# EAGLE design LPC_4TE_TOP_3_53c (EAGLE 5.04)

## Sheet 1 of 2
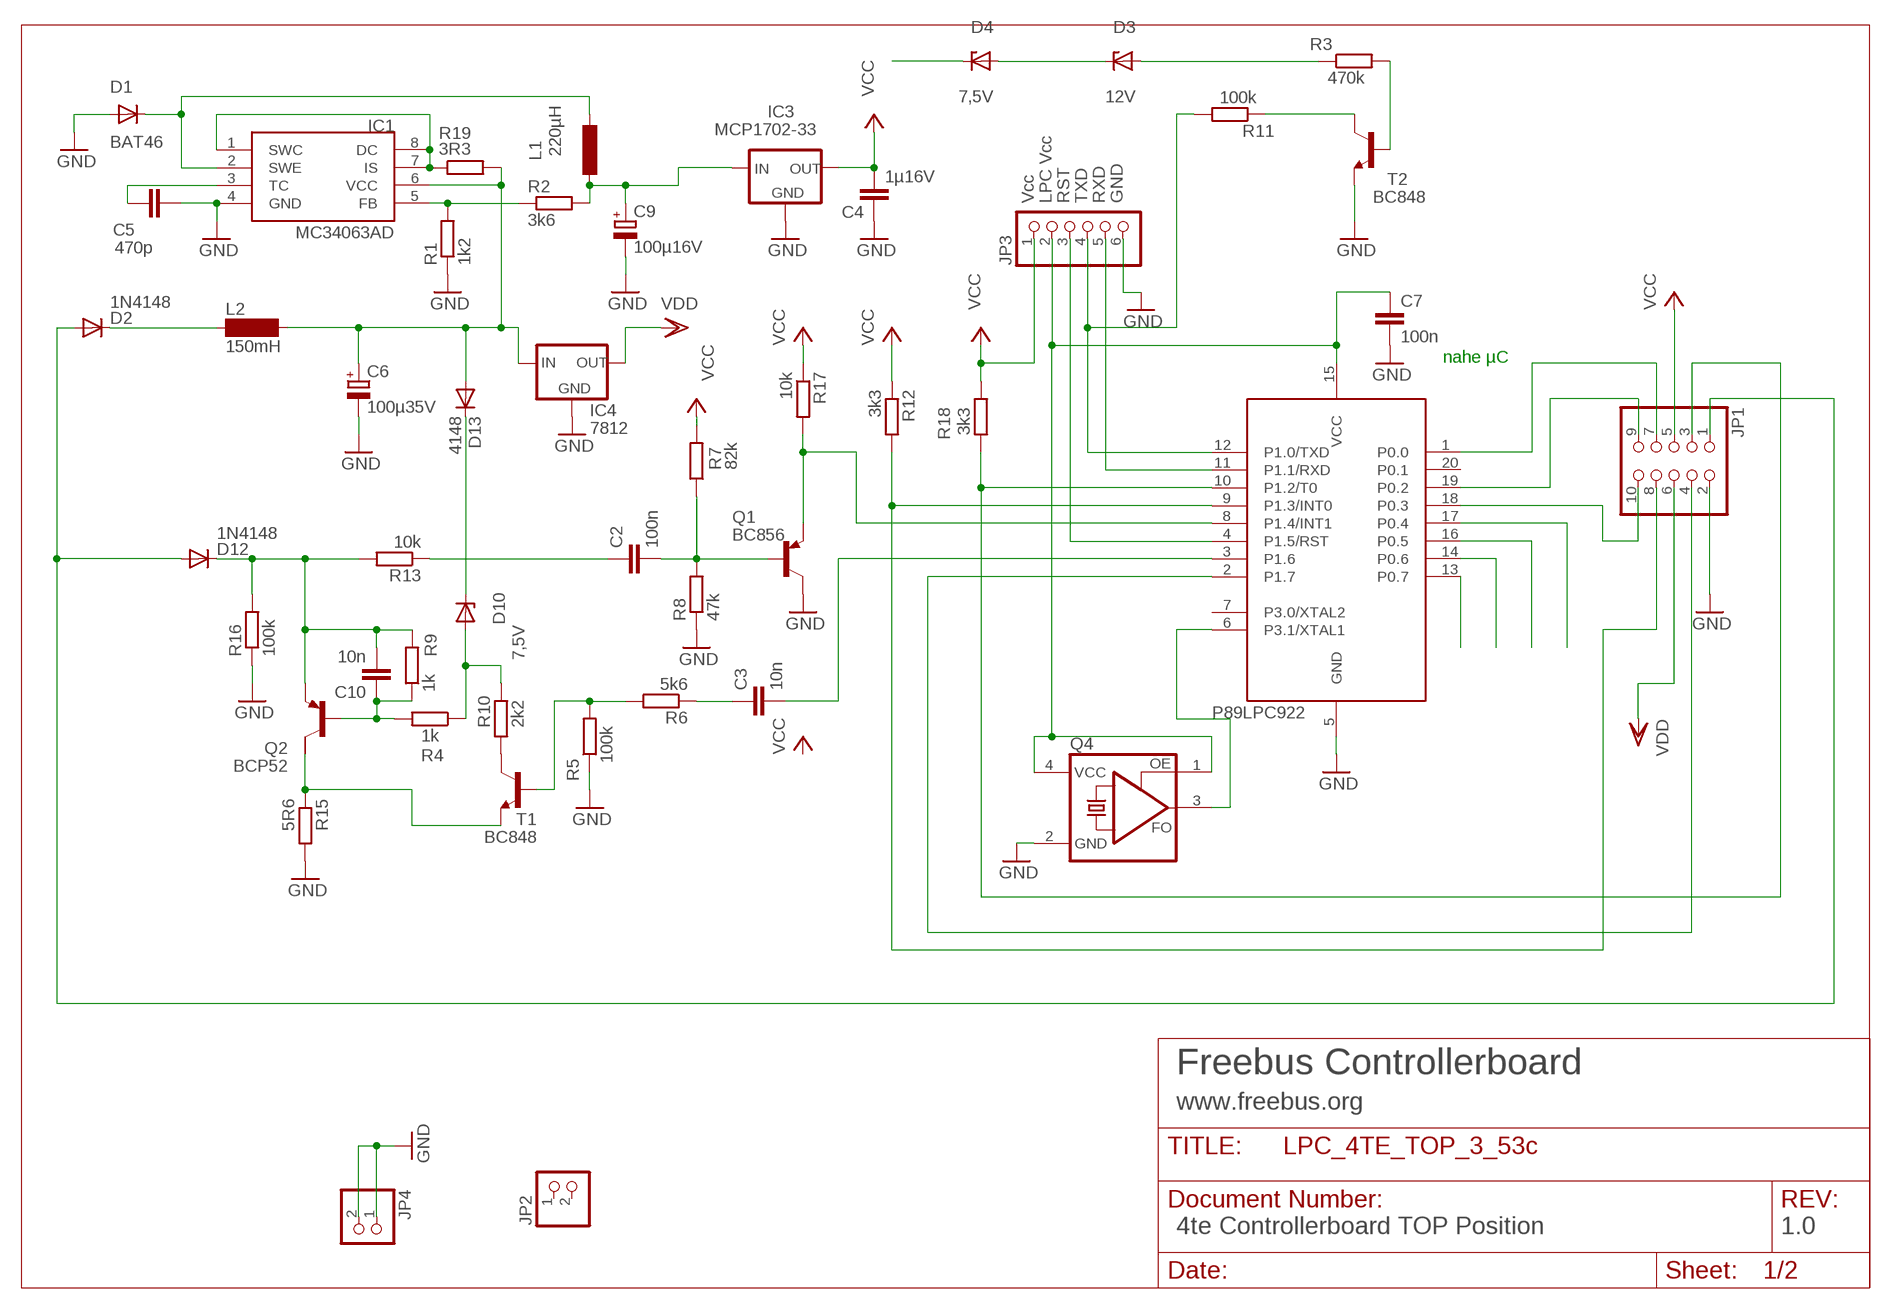
[diagram p0: schematic, sheet 1]

### Parts
C2  100n  C-EUC1206  [C1206]
C3  10n  C-EUC1206  [C1206]
C4  1µ16V  C-EUC1206  [C1206]
C5  470p  C-EUC1206  [C1206]
C6  100µ35V  CPOL-EUE5-8.5  [E5-8,5]
C7  100n  C-EUC1206  [C1206]
C9  100µ16V  CPOL-EUE2.5-5  [E2,5-5]
C10  10n  C-EUC1206  [C1206]
D1  BAT46  DIODE-MINIMELF  [MINIMELF]
D2  1N4148  DIODE-MINIMELF  [MINIMELF]
D3  12V  ZPD  [MINIMELF]
D4  7,5V  ZPD  [MINIMELF]
D10  7,5V  ZPD  [MINIMELF]
D12  1N4148  DIODE-MINIMELF  [MINIMELF]
D13  4148  DIODE-MINIMELF  [MINIMELF]
IC1  MC34063AD  [SOIC8]
IC3  MCP1702-33  79LXX  [79LXX]
IC4  7812  78XXS  [78XXS]
JP1  PINHD-2X5  [2X05]
JP2  PINHD-1X2  [1X02]
JP3  PINHD-1X6  [1X06]
JP4  PINHD-1X2  [1X02]
L1  220µH  L-EU2200-11.43  [2200-11.43]
L2  150mH  SD12-1000  [SD12_1000]
Q1  BC856  BC856ALT1SMD  [SOT23-BEC]
Q2  BCP52  FZT753SMD  [SOT223]
Q4  ASFL  [ASF]
R1  1k2  R-EU_R1206  [R1206]
R2  3k6  R-EU_M1206  [M1206]
R3  470k  R-EU_R1206  [R1206]
R4  1k  R-EU_R1206  [R1206]
R5  100k  R-EU_R1206  [R1206]
R6  5k6  R-EU_R1206  [R1206]
R7  82k  R-EU_R1206  [R1206]
R8  47k  R-EU_M1206  [M1206]
R9  1k  R-EU_R1206  [R1206]
R10  2k2  R-EU_M1206  [M1206]
R11  100k  R-EU_R1206  [R1206]
R12  3k3  R-EU_R1206  [R1206]
R13  10k  R-EU_R1206  [R1206]
R15  5R6  R-EU_R1206  [R1206]
R16  100k  R-EU_M1206  [M1206]
R17  10k  R-EU_R1206  [R1206]
R18  3k3  R-EU_M1206  [M1206]
R19  3R3  R-EU_M1206  [M1206]
T1  BC848  [SOT23]
T2  BC848  [SOT23]
U1  89LPC922  [DIL20]

### Nets
DRAIN: R10.1 T1.3(C)
EIB+: D2.A D12.A JP1.1
EIB_DC: C6.+ D4.C D13.A IC1.6(VCC) IC4.IN L2.2 R19.2
EIB_SEND: C3.2 U1.3(P1.6)
EIBIN: Q1.E R17.2 U1.8(P1.4/INT1)
GATE: R5.2 R6.2 T1.1(B)
GND: C4.1 C5.2 C6.- C7.2 C9.- D1.A IC1.4(GND) IC3.GND IC4.GND JP1.2 JP3.6 JP4.1 JP4.2 Q1.C Q4.2(GND) R1.1 R5.1 R8.1 R15.2 R16.1 T2.2(E) U1.5(GND) ; also sheet 2
INT0: JP1.8 R12.2 U1.9(P1.3/INT0)
N$4: C10.1 Q2.1(B) R4.2 R9.1
N$5: C3.1 R6.1
N$6: C10.2 D12.C Q2.3(E) R9.2 R13.2 R16.2
N$7: Q2.2(C) R15.1 T1.2(E)
N$8: D2.C L2.1
N$9: JP3.5 U1.11(P1.1/RXD)
N$16: JP3.3 U1.4(P1.5/RST)
N$17: D3.C D4.A
N$19: D3.A R3.1
N$20: R3.2 T2.1(B)
N$21: R11.1 T2.3(C)
N$24: JP3.4 R11.2 U1.12(P1.0/TXD)
N$25: Q4.3(FO) U1.6(P3.1/XTAL1)
N$26: C9.+ IC3.IN L1.1 R2.2
N$31: C2.2 Q1.B R7.1 R8.2
N$50: IC1.5(FB) R1.2 R2.1
N$51: D1.C IC1.2(SWE) L1.2
N$52: C5.1 IC1.3(TC)
N$55: D10.A R4.1 R10.2
N$58: D10.C D13.C
N$63: IC1.1(SWC) IC1.7(IS) IC1.8(DC) R19.1
N$77: C2.1 R13.1
P0.0: JP1.7 U1.1(P0.0)
P0.2: JP1.9 U1.19(P0.2)
P0.3: JP1.10 U1.18(P0.3)
P04: U1.17(P0.4) ; also sheet 2
P05: U1.16(P0.5) ; also sheet 2
P06: U1.14(P0.6) ; also sheet 2
P07: U1.13(P0.7)
PROG: JP1.4 U1.2(P1.7)
PWM: JP1.3 R18.2 U1.10(P1.2/T0)
VCC: C4.2 IC3.OUT JP1.5 JP3.1 R7.2 R12.1 R17.1 R18.1 ; also sheet 2
VCC_LPC: C7.1 JP3.2 Q4.1(OE) Q4.4(VCC) U1.15(VCC)
VDD: IC4.OUT JP1.6
Unconnected: JP2.1 JP2.2 Q2.4(C/) U1.7(P3.0/XTAL2) U1.20(P0.1)

### Notes on the sheet
- Vcc | LPC Vcc | RST | TXD | RXD | GND
- nahe µC
- P89LPC922
- Freebus Controllerboard
- www.freebus.org
- 4te Controllerboard TOP Position | 1.0

## Sheet 2 of 2
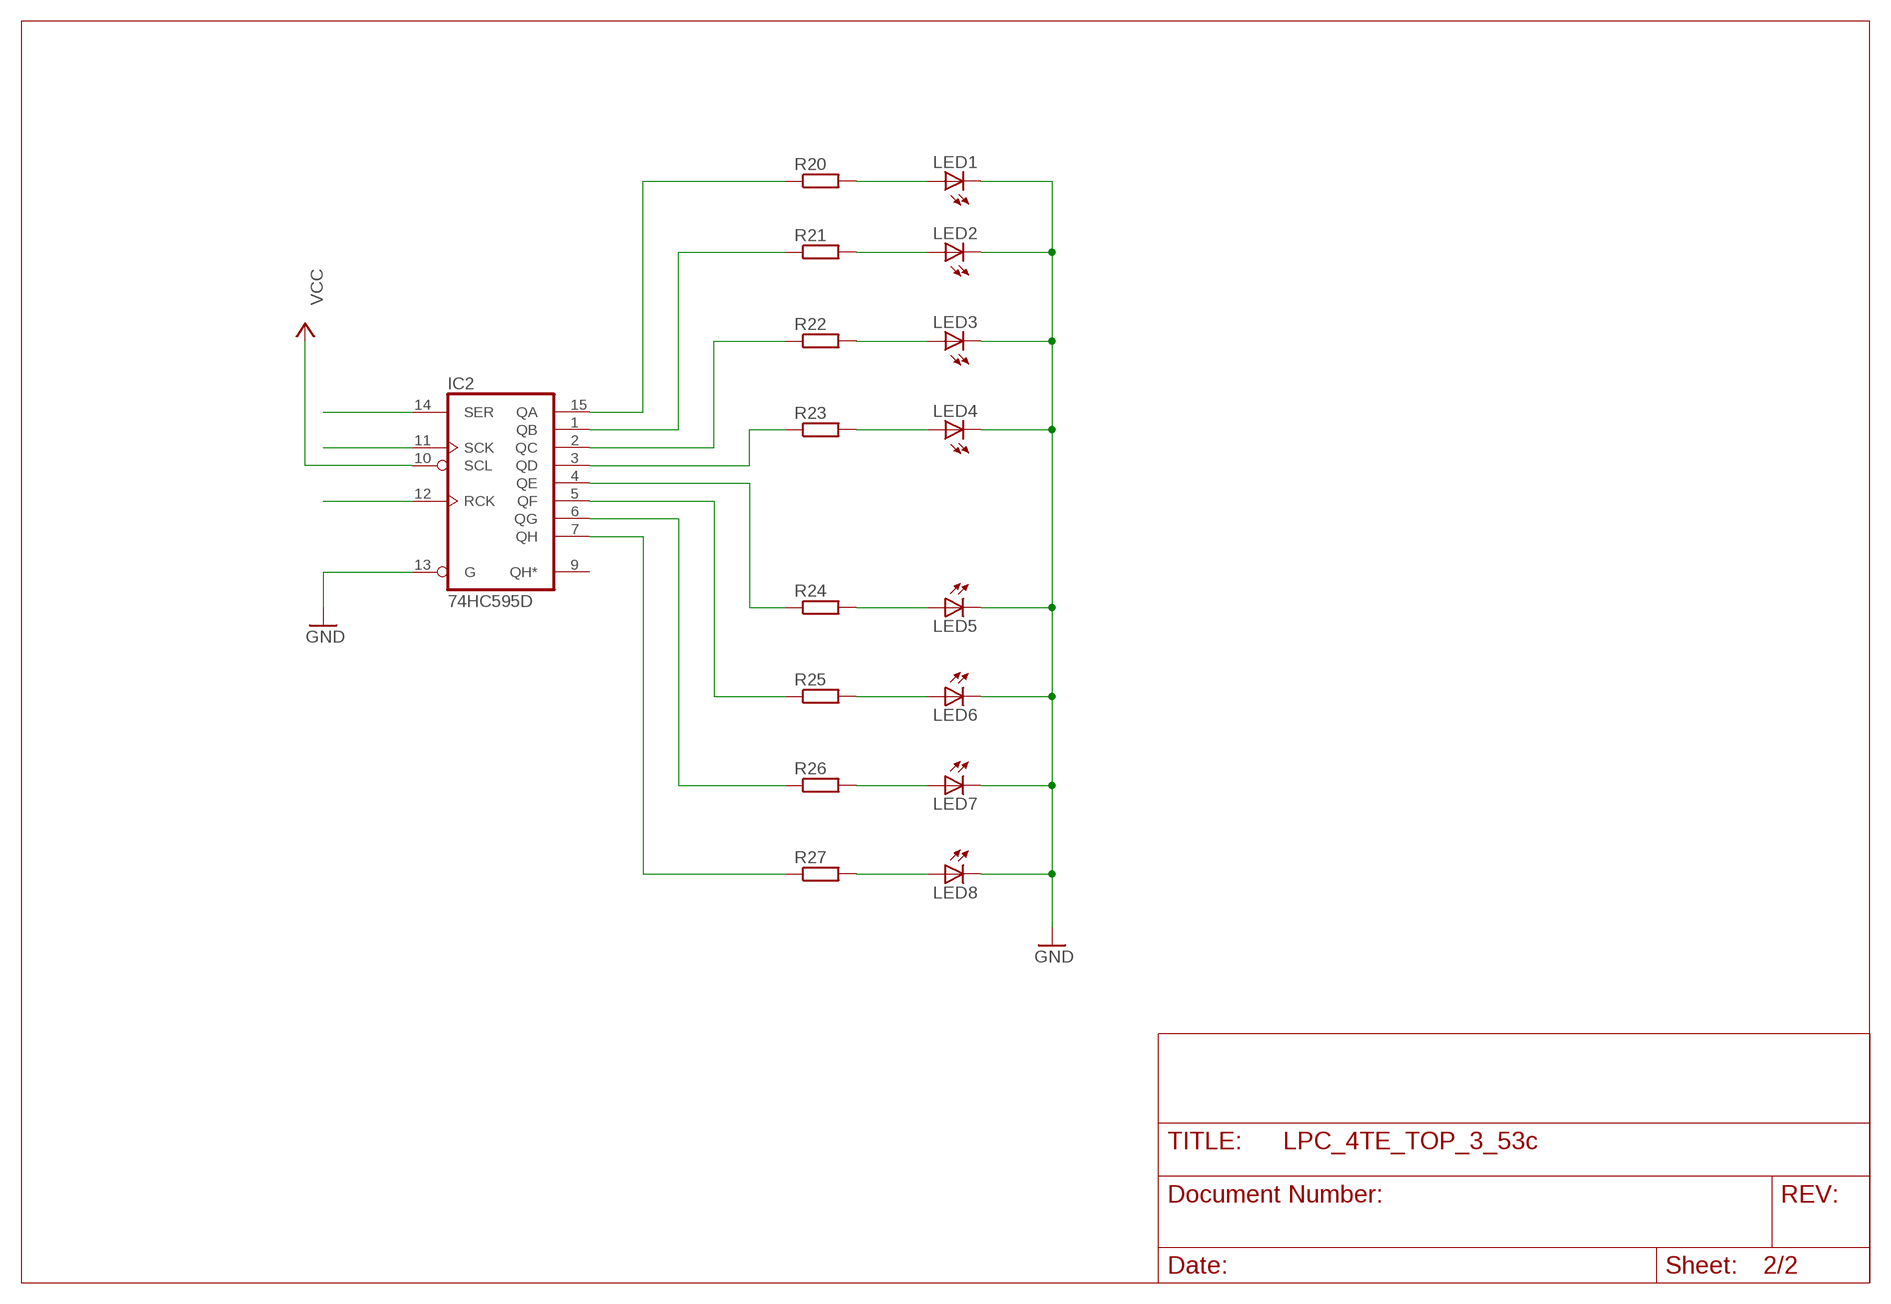
[diagram p1: schematic, sheet 2]

### Parts
IC2  74HC595D  [SO16]
LED1  LED3MM  [LED3MM]
LED2  LED3MM  [LED3MM]
LED3  LED3MM  [LED3MM]
LED4  LED3MM  [LED3MM]
LED5  LED3MM  [LED3MM]
LED6  LED3MM  [LED3MM]
LED7  LED3MM  [LED3MM]
LED8  LED3MM  [LED3MM]
R20  R-EU_R1206  [R1206]
R21  R-EU_R1206  [R1206]
R22  R-EU_R1206  [R1206]
R23  R-EU_R1206  [R1206]
R24  R-EU_R1206  [R1206]
R25  R-EU_R1206  [R1206]
R26  R-EU_R1206  [R1206]
R27  R-EU_R1206  [R1206]

### Nets
GND: IC2.13(G) LED1.K(C) LED2.K(C) LED3.K(C) LED4.K(C) LED5.K(C) LED6.K(C) LED7.K(C) LED8.K(C) ; also sheet 1
N$1: LED1.A R20.2
N$2: LED2.A R21.2
N$3: LED3.A R22.2
N$10: LED4.A R23.2
N$11: LED5.A R24.2
N$13: LED6.A R25.2
N$15: LED7.A R26.2
N$18: LED8.A R27.2
N$22: IC2.15(QA) R20.1
N$23: IC2.1(QB) R21.1
N$28: IC2.2(QC) R22.1
N$29: IC2.3(QD) R23.1
N$30: IC2.7(QH) R27.1
N$32: IC2.6(QG) R26.1
N$33: IC2.5(QF) R25.1
N$34: IC2.4(QE) R24.1
P04: IC2.14(SER) ; also sheet 1
P05: IC2.11(SCK) ; also sheet 1
P06: IC2.12(RCK) ; also sheet 1
VCC: IC2.10(SCL) ; also sheet 1
Unconnected: IC2.9(QH*)

## Power pins joined to a net without a drawn wire
GND: IC2.8(GND)
VCC: IC2.16(VCC)

## Library data of the parts
C2-C5 C7 C10 = rcl:C-EU: CAPACITOR, European symbol
C6 C9 = rcl:CPOL-EU: POLARIZED CAPACITOR, European symbol
D1 D2 D12 D13 = diode:DIODE-: DIODE
D3 D4 D10 = diode:ZPD: Z DIODE 500 mW
IC1 = mc34063:MC34063
IC2 = 74xx-eu:74*595: 8-bit SHIFT REGISTER, output latch
IC3 = v-reg:79LXX: VOLTAGE REGULATOR
IC4 = v-reg:78XXS: VOLTAGE REGULATOR
JP1 = pinhead:PINHD-2X5: PIN HEADER
JP2 JP4 = pinhead:PINHD-1X2: PIN HEADER
JP3 = pinhead:PINHD-1X6: PIN HEADER
L1 = rcl:L-EU: INDUCTOR, European symbol
L2 = inductor-neosid:SD12: INDUCTOR nominal inductance
LED1-LED8 = led:LED: LED OSRAM: - CHIPLED LG R971, LG N971, LY N971, LG Q971, LY Q971, LO R971, LY R971 LH N974, LH R974 LS Q976, LO Q976, LY Q976 LO Q996 - Hyper CHIPLED LW Q18S LB Q993, LB Q99A, LB R99A - SideLED LS A670, LO A670, LY A670, LG A670, LP A670 LB A673, LV A673, LT A673, LW A673 LH A674 LY A675 LS A676, LA A676, LO A676, LY A676, LW A676 LS A679, LY A679, LG A679 - Hyper Micro SIDELED® LS Y876, LA Y876, LO Y876, LY Y876 LT Y87S - SmartLED LW L88C, LW L88S LB L89C, LB L89S, LG L890 LS L89K, LO L89K, LY L89K LS L896, LA L896, LO L896, LY L896 - TOPLED LS T670, LO T670, LY T670, LG T670, LP T670 LSG T670, LSP T670, LSY T670, LOP T670, LYG T670 LG T671, LOG T671, LSG T671 LB T673, LV T673, LT T673, LW T673 LH T674 LS T676, LA T676, LO T676, LY T676, LB T676, LH T676, LSB T676, LW T676 LB T67C, LV T67C, LT T67C, LS T67K, LO T67K, LY T67K, LW E67C LS E67B, LA E67B, LO E67B, LY E67B, LB E67C, LV E67C, LT E67C LW T67C LS T679, LY T679, LG T679 LS T770, LO T770, LY T770, LG T770, LP T770 LB T773, LV T773, LT T773, LW T773 LH T774 LS E675, LA E675, LY E675, LS T675 LS T776, LA T776, LO T776, LY T776, LB T776 LHGB T686 LT T68C, LB T68C - Hyper Mini TOPLED® LB M676 - Mini TOPLED Santana® LG M470 LS M47K, LO M47K, LY M47K Source: http://www.osram.convergy.de - LUMILED® LXK2-PW12-R00, LXK2-PW12-S00, LXK2-PW14-U00, LXK2-PW14-V00 LXK2-PM12-R00, LXK2-PM12-S00, LXK2-PM14-U00 LXK2-PE12-Q00, LXK2-PE12-R00, LXK2-PE12-S00, LXK2-PE14-T00, LXK2-PE14-U00 LXK2-PB12-K00, LXK2-PB12-L00, LXK2-PB12-M00, LXK2-PB14-N00, LXK2-PB14-P00, LXK2-PB14-Q00 LXK2-PR12-L00, LXK2-PR12-M00, LXK2-PR14-Q00, LXK2-PR14-R00 LXK2-PD12-Q00, LXK2-PD12-R00, LXK2-PD12-S00 LXK2-PH12-R00, LXK2-PH12-S00 LXK2-PL12-P00, LXK2-PL12-Q00, LXK2-PL12-R00 Source: www.luxeon.com
Q1 = transistor-pnp:BC856*: PNP Transistror
Q2 = transistor-pnp:FZT753SMD: PNP Transistor
Q4 = crystal:ASF*: CRYSTAL CLOCK OSCILLATORS 5.0 Vdc or 3.3 Vdc - LOW PROFILE ULTRA MINIATURE CERAMIC SURFACE MOUNT Source: http://www.abracon.com/Oscillators/asf1-L-L1.pdf
R1-R13 R15-R27 = rcl:R-EU_: RESISTOR, European symbol
T1 T2 = transistor:BC848: NPN TRANSISTOR
U1 = micro-philips:89LPC922

## Board
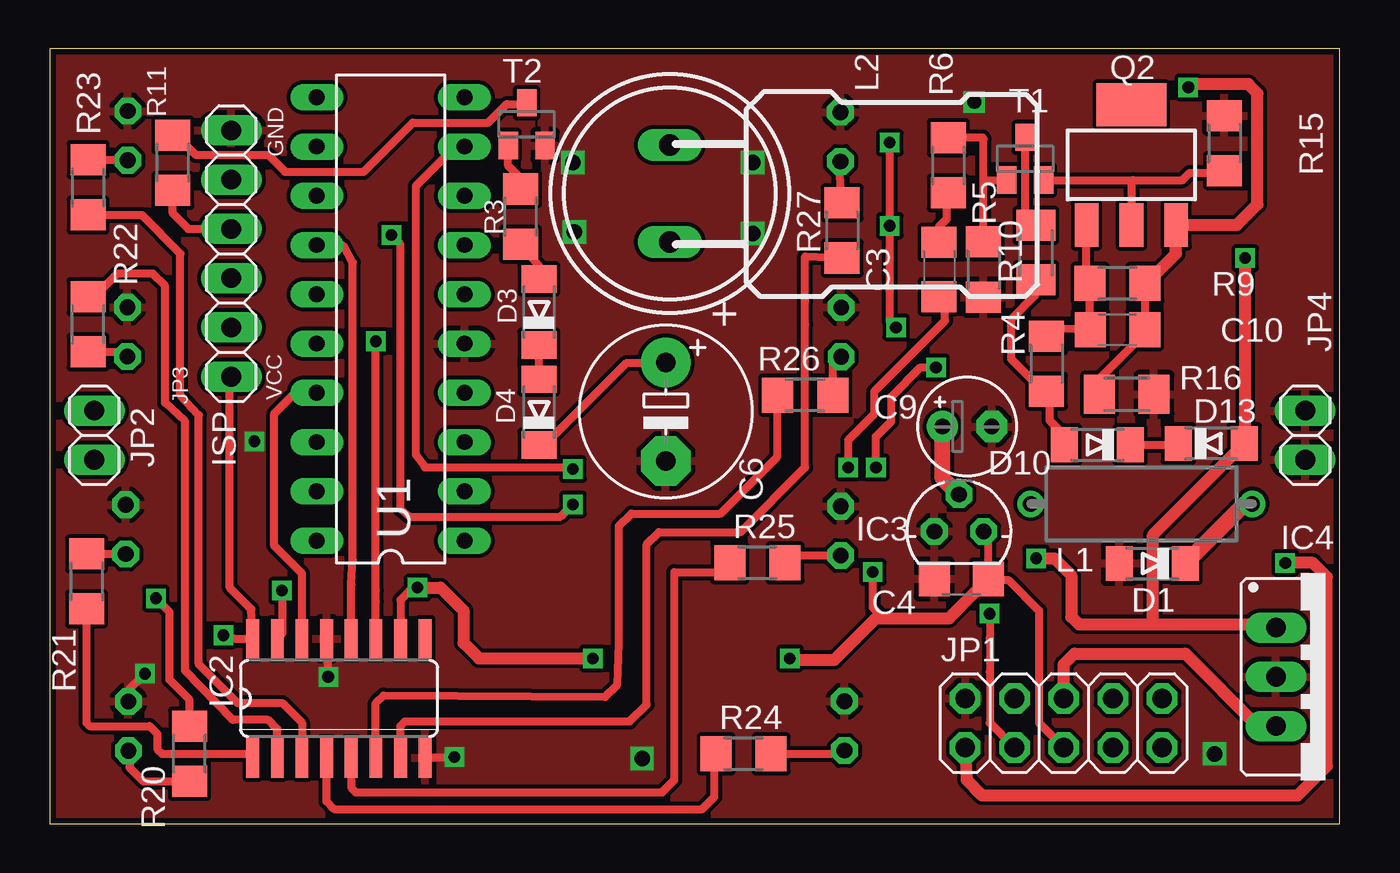
[diagram p2: board, top side]
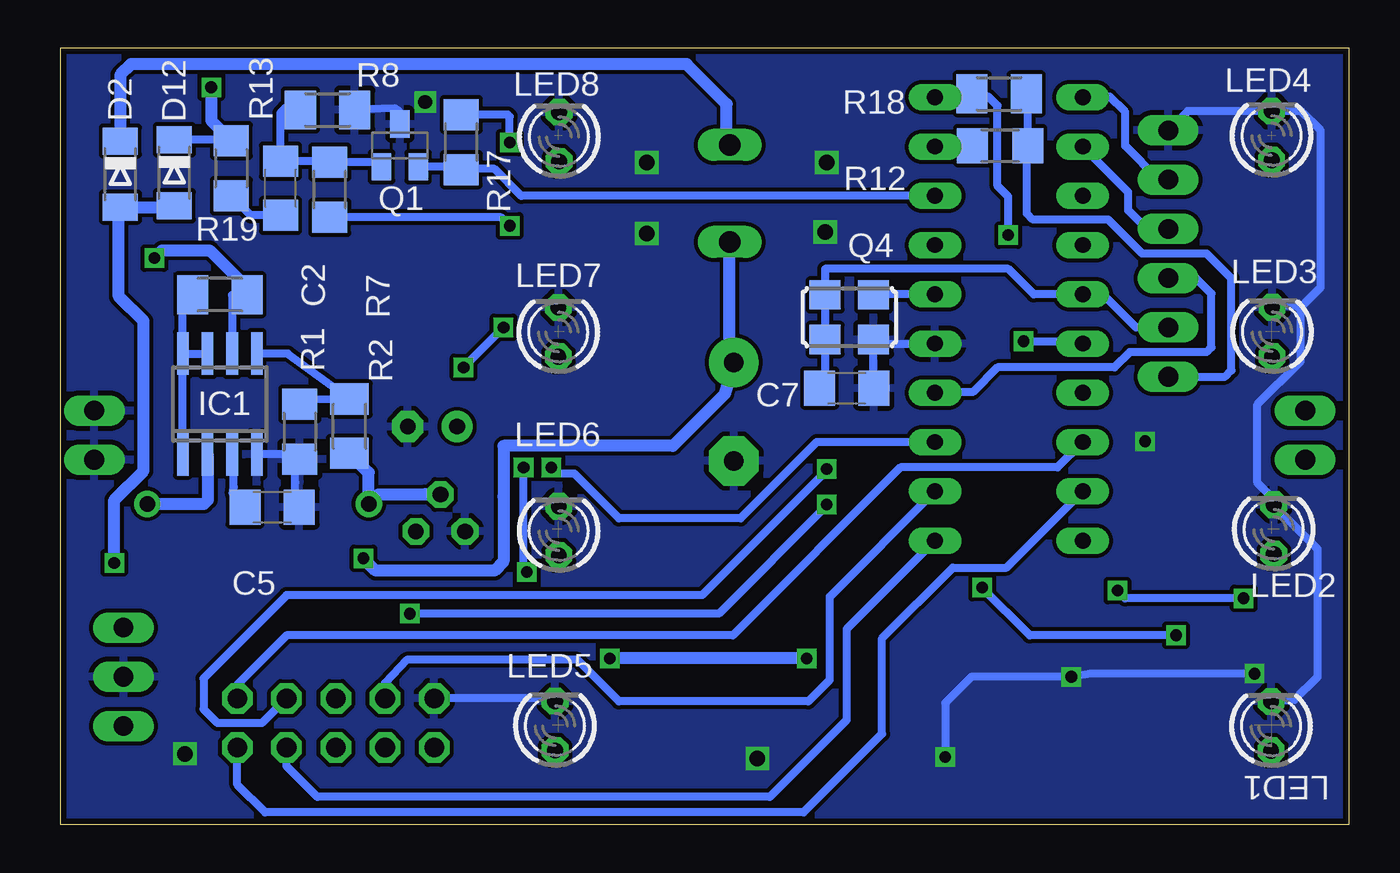
[diagram p3: board, bottom side, seen from below]

Size 66.5 x 40 mm. Coordinates in mm from the lower left corner, seen from the top.
Outline: 0,40 66.5,40 66.5,0 0,0 0,40
Copper layers (1*16): Top 0.035mm / dielectric 1.5mm / Bottom 0.035mm
Design rules "default_freebus": minimum track width 10mil, minimum drill 24mil, track to track 8mil, track to pad 8mil, pad to pad 8mil, via to via 8mil, smd to smd 8mil, copper to edge 12mil, drill to drill 8mil, minimum pad ring 11mil, minimum via ring 8mil, stop-mask expansion 4mil, vias tented up to drill 0mil, thermal gap 10mil

### Footprints (pad centres in the part's own frame; a part is rotated, then mirrored left to right if it is on the bottom)
C1206 = smd 1.6 x 1.8: 1 -1.4,0; 2 1.4,0
E5-8,5 = drill 1.016 pad 2.54 round: + -2.54,0 | drill 1.016 pad 2.54 octagon: - 2.54,0
E2,5-5 = drill 0.813 pad 1.6 round: + -1.27,0 | drill 0.813 pad 1.6 octagon: - 1.27,0
MINIMELF = smd 1.4 x 1.8: A 1.7,0; C -1.7,0
SOIC8 = smd 0.6 x 2.2: 1 -1.905,-2.6; 2 -0.635,-2.6; 3 0.635,-2.6; 4 1.905,-2.6; 5 1.905,2.6; 6 0.635,2.6; 7 -0.635,2.6; 8 -1.905,2.6
SO16 = smd 0.66 x 2.032: 1 -4.445,-3.073; 2 -3.175,-3.073; 3 -1.905,-3.073; 4 -0.635,-3.073; 5 0.635,-3.073; 6 1.905,-3.073; 7 3.175,-3.073; 8 4.445,-3.073; 9 4.445,3.073; 10 3.175,3.073; 11 1.905,3.073; 12 0.635,3.073; 13 -0.635,3.073; 14 -1.905,3.073; 15 -3.175,3.073; 16 -4.445,3.073
79LXX = drill 0.813 octagon: GND -1.27,0; IN 0,1.905; OUT 1.27,0
78XXS = drill 1.016 long: GND 0,-2.54; IN -2.54,-2.54; OUT 2.54,-2.54
2X05 = drill 1.016 octagon: 1 -5.08,-1.27; 2 -5.08,1.27; 3 -2.54,-1.27; 4 -2.54,1.27; 5 0,-1.27; 6 0,1.27; 7 2.54,-1.27; 8 2.54,1.27; 9 5.08,-1.27; 10 5.08,1.27
1X02 = drill 1.016 long: 1 -1.27,0; 2 1.27,0
1X06 = drill 1.016 long: 1 -6.35,0; 2 -3.81,0; 3 -1.27,0; 4 1.27,0; 5 3.81,0; 6 6.35,0
2200-11.43 = drill 0.8 pad 1.27 round: 1 -5.715,0; 2 5.715,0
SD12_1000 = drill 1.1 long: 1 -2.5,0; 2 2.5,0
LED3MM = drill 0.813 octagon: A -1.27,0; K 1.27,0
SOT23-BEC = smd 1 x 1.4: B -0.95,-1.1; C 0,1.1; E 0.95,-1.1
SOT223 = smd 1.219 x 2.235: 1 -2.311,-3.099; 2 0,-3.099; 3 2.311,-3.099 | smd 3.6 x 2.2: 4 0,3.099
ASF = smd 1.6 x 1.5: 1 -1.25,-1.15; 2 1.25,-1.15; 3 1.25,1.15; 4 -1.25,1.15
R1206 = smd 1.6 x 1.803: 1 -1.422,0; 2 1.422,0
M1206 = smd 1.6 x 2: 1 -1.4,0; 2 1.4,0
SOT23 = smd 1 x 1.4: 1 -0.95,-1.1; 2 0.95,-1.1; 3 0,1.1
DIL20 = drill 0.813 long: 1 -11.43,-3.81; 2 -8.89,-3.81; 3 -6.35,-3.81; 4 -3.81,-3.81; 5 -1.27,-3.81; 6 1.27,-3.81; 7 3.81,-3.81; 8 6.35,-3.81; 9 8.89,-3.81; 10 11.43,-3.81; 11 11.43,3.81; 12 8.89,3.81; 13 6.35,3.81; 14 3.81,3.81; 15 1.27,3.81; 16 -1.27,3.81; 17 -3.81,3.81; 18 -6.35,3.81; 19 -8.89,3.81; 20 -11.43,3.81

### Placement (x,y rotation side)
C2  55.13,32.8 90 bottom
C3  45.85,28.6 270 top
C4  47,12.64 0 top
C5  55.56,16.35 0 bottom
C6  31.75,21.27 270 top
C7  25.93,22.49 0 bottom
C9  47.3,20.51 0 top
C10  55.05,25.51 0 top
D1  56.85,13.44 180 top
D2  63.39,33.52 270 bottom
D3  25.21,26.41 90 top
D4  25.21,21.25 90 top
D10  54.01,19.57 180 top
D12  60.61,33.59 270 bottom
D13  59.9,19.63 0 top
IC1  58.26,21.67 0 bottom
IC2  14.89,6.49 0 top
IC3  46.88,15.1 0 top
IC4  65.77,7.6 270 top
JP1  52.28,5.22 0 top
JP2  2.27,20.06 90 top
JP3  9.34,29.43 90 top
JP4  64.74,20.06 90 top
L1  56.29,16.52 0 top
L2  31.96,32.53 270 top
LED1  4.03,5.06 90 bottom
LED2  3.89,15.2 90 bottom
LED3  3.98,25.39 90 bottom
LED4  4,35.5 90 bottom
LED5  40.97,5.07 90 bottom
LED6  40.78,15.13 90 bottom
LED7  40.8,25.38 90 bottom
LED8  40.77,35.45 90 bottom
Q1  48.97,35 0 bottom
Q2  55.77,34 0 top
Q4  25.79,26.14 0 bottom
R1  54.13,20.24 90 bottom
R2  51.58,20.53 270 bottom
R3  24.26,31.33 90 top
R4  51.39,23.75 90 top
R5  48.15,28.6 90 top
R6  46.32,33.98 90 top
R7  52.59,32.72 270 bottom
R8  52.71,36.83 180 bottom
R9  55.05,27.89 0 top
R10  50.85,29.47 270 top
R11  6.32,34.11 270 top
R12  18.01,34.99 180 bottom
R13  57.67,33.83 90 bottom
R15  60.57,35.12 90 top
R16  55.53,22.17 180 top
R17  45.81,35.17 270 bottom
R18  18.06,37.66 180 bottom
R19  58.26,27.31 0 bottom
R20  7.19,3.63 270 top
R21  1.87,12.52 90 top
R22  1.95,25.78 270 top
R23  1.95,32.84 90 top
R24  35.77,3.63 0 top
R25  36.48,13.47 0 top
R26  38.94,22.13 0 top
R27  40.85,30.62 90 top
T1  50.29,34.32 0 top
T2  24.58,36.09 0 top
U1  17.56,26.05 90 top

### Tracks (layer width: path | path; a pad name or v marks a point on that pad's centre or on a via)
DRAIN
  Top 0.406: 50.69,30.79 R10.1 50.29,31.43 T1.3
EIB+  (via drill 0.6)
  Top 0.61: JP1.1 47.28,2.28 48.07,1.49 64.34,1.49 65.85,3 65.85,12.76 65.14,13.47 v63.71,13.47 63.87,13.31
  Bottom 0.61: D12.A 60.68,31.82 D2.A 63.47,31.74 63.47,27.21 62.2,25.94 62.2,18.24 63.71,16.73 v63.71,13.47
EIB_DC  (via drill 0.6)
  Top 0.406: D4.C 25.65,19.71 29.73,23.79 31.73,23.79 C6.+
  Top 0.61: 56.88,10.3 56.88,14.92 D13.A 61.64,19.68 v61.64,29.19 | v50.85,13.71 51.8,13.71 52.67,12.84 52.67,10.7 53.07,10.3 56.88,10.3 | 56.88,10.3 63.07,10.3 IC4.IN
  Bottom 0.406: IC1.6 57.63,27.28 R19.2
  Bottom 0.61: R19.2 56.86,27.66 58.79,29.59 61.25,29.59 v61.64,29.19 | L2.2 31.96,23.68 C6.+ 32.23,22.17 34.89,19.51 43.63,19.51 43.63,16.89 43.63,13.55 44.1,13.08 50.21,13.08 v50.85,13.71
EIB_SEND  (via drill 0.6)
  Top 0.406: C3.2 46.16,26.41 46.16,25.97 42.51,22.32 42.51,21.17 41.16,19.82 v41.16,18.39
  Bottom 0.406: U1.3 27.47,19.7 31.4,15.78 37.67,15.78 39.97,18.08 40.85,18.08 v41.16,18.39
EIBIN
  Bottom 0.406: Q1.E 45.96,33.9 R17.2 | R17.2 45.42,33.75 | U1.8 42.71,32.4 44.1,33.79 45.76,33.79 R17.2
GATE
  Top 0.406: R6.2 48.09,35.4 48.15,35.34 48.15,33.27 | 48.15,33.27 48.15,30.1 R5.2 | T1.1 48.2,33.22 48.15,33.27
GND  (via drill 0.6, 0.7, 0.8)
  Top 0.406: R5.1 48.62,27.34 | LED1.K 4.03,6.9 v4.89,7.76 | v14.34,7.6 14.34,9.48 IC2.13 | IC2.8 20.79,3.41 v20.84,3.47
  Bottom 0.406: C5.2 54.4,16.72 54.37,17.62 54.37,18.9 R1.1 | IC1.4 54.38,19.07 R1.1 | R1.1 53.98,19.29 | R8.1 49.24,36.91 49.02,36.77 49.02,36.15 Q1.C | 2.75,26.73 3.91,26.73 LED3.K | 2.75,26.73 2.43,26.73 1.48,27.68 1.48,35.78 2.47,36.78 LED4.K 8.34,36.78 JP3.6 | 2.75,26.73 2.51,26.49 2.51,23.87 4.73,21.65 4.73,17.6 3.89,16.76 LED2.K 3.89,16.44 1.64,14.19 1.64,7.6 2.83,6.41 3.95,6.41 LED1.K | U1.5 24.33,24.78 Q4.2 C7.2 | v4.89,7.76 13.3,7.76 v14.34,7.6 19.5,7.6 20.84,6.25 v20.84,3.47 | LED5.K 41.11,6.49 JP1.2
  other vias: 47.67,37.24 26.96,34.11 27.04,30.54 36.24,34.11 36.24,30.46 30.53,3.39 60.06,3.63 10.53,19.74
  pour Top: -0.75,41.33 66.25,41.33 67.76,39.83 67.76,0.38 66.33,-1.05 -0.51,-1.05 -1.14,-0.42
  pour Bottom: -0.98,42.68 67.28,42.68 68.31,41.65 68.31,0.38 66.8,-1.13 -0.9,-1.13 -1.38,-0.66
INT0  (via drill 0.6)
  Top 0.406: U1.9 20.88,34.94 18.86,32.92 18.86,19.03 19.34,18.39 26.72,18.39 v26.96,18.32
  Bottom 0.406: R12.2 21.34,34.91 U1.9 | v26.96,18.32 26.96,18.24 33.39,11.81 54.82,11.81 59.1,7.52 59.1,5.93 58.39,5.22 56.09,5.22 JP1.8
N$1
  Top 0.406: R20.2 4.8,2.21 4.1,2.92 4.1,3.72 LED1.A
N$2
  Top 0.406: R21.2 3.89,13.94 LED2.A
N$3
  Top 0.406: R22.2 3.98,24.35 LED3.A
N$4
  Top 0.406: Q2.1 53.46,28.06 R9.1 53.63,25.53 | 53.63,25.53 C10.1 | 53.63,25.53 52.04,25.57 R4.2
N$5
  Top 0.406: C3.1 45.85,30.81 46.24,31.21 46.24,32.47 R6.1
N$6  (via drill 0.6)
  Top 0.406: R9.2 56.48,25.53 C10.2 56.45,25.31 54.18,23.03 54.18,22.22 R16.2
  Top 0.61: R9.2 56.53,27.89 58.07,29.43 Q2.3 61.21,30.9 62.28,31.97 62.28,37.68 61.8,38.16 58.87,38.16 v58.71,38
  Bottom 0.406: D12.C 57.79,35.29 57.67,35.5 R13.2
  Bottom 0.61: v58.71,38 58.71,36.28 R13.2
N$7
  Top 0.406: T1.2 55.85,33.22 | Q2.2 55.77,33.14 55.85,33.22 | 55.85,33.22 58.41,33.22 58.78,33.59 60.45,33.59 R15.1
N$8
  Bottom 0.61: D2.C 63.39,38.63 62.83,39.19 34.18,39.19 32.12,37.13 32.12,35.18 L2.1
N$9
  Bottom 0.406: JP3.5 9.81,33.24 11.56,34.98 11.56,36.73 12.35,37.52 13.71,37.52 U1.11
N$10
  Top 0.406: R23.2 4,34.26 LED4.A
N$11
  Top 0.406: R24.2 40.8,3.63 LED5.A
N$13
  Top 0.406: R25.2 38.29,13.86 LED6.A
N$15
  Top 0.406: R26.2 40.36,23.67 LED7.A
N$16
  Bottom 0.406: JP3.3 7.91,28.16 7.11,27.36 7.11,24.59 7.35,24.35 11.32,24.35 12.11,23.55 18.15,23.55 19.42,22.28 21.33,22.28 U1.4
N$17
  Top 0.406: D4.A 25.21,25.11 D3.C
N$18
  Top 0.406: R27.2 40.68,34.09 LED8.A
N$19
  Top 0.406: D3.A 25.21,28.8 R3.1
N$20
  Top 0.406: R3.2 24.26,33.32 23.62,33.95 T2.1
N$21
  Top 0.406: R11.1 6.48,35.53 7.51,34.51 11.24,34.51 12.11,33.63 16.16,33.63 18.7,36.17 22.59,36.17 23.54,37.13 24.51,37.13 T2.3
N$22  (via drill 0.6)
  Top 0.406: R20.1 7.19,6.41 6.16,7.44 6.16,10.93 v5.45,11.65 | v11.95,12.04 11.95,9.8 IC2.15
  Bottom 0.406: v5.45,11.65 11.56,11.65 v11.95,12.04
N$23
  Top 0.406: R21.1 1.87,5.22 2.03,5.06 5.13,5.06 5.53,4.66 5.53,3.87 5.76,3.63 10.23,3.63 IC2.1
N$24
  Top 0.406: JP3.4 7.11,30.7 6.32,31.49 R11.2
  Bottom 0.406: JP3.4 10.45,30.7 11.4,31.65 11.4,32.59 U1.12
N$25
  Bottom 0.406: U1.6 24.51,27.32 Q4.3
N$26
  Top 0.813: C9.+ 46.03,17.85 IC3.IN
  Bottom 0.61: 47.67,17.02 IC3.IN 50.09,17 L1.1 50.58,18.13 R2.2
N$28
  Top 0.406: R22.1 2.26,27.2 3.46,28.4 5.29,28.4 5.92,27.76 5.92,21.73 6.95,20.78 6.95,7.92 9.41,5.38 11.24,5.38 11.72,4.9 IC2.2
N$29
  Top 0.406: R23.1 1.64,31.41 4.73,31.41 6.72,29.43 6.72,22.13 7.67,21.09 7.67,8.23 9.65,6.25 11.95,6.25 12.99,5.22 IC2.3
N$30
  Top 0.406: IC2.7 18.07,5.06 18.3,5.3 29.89,5.3 30.77,6.17 30.77,14.43 31.4,15.06 35.61,15.06 38.94,18.39 38.94,25.78 38.94,26.97 38.94,29.28 R27.1
N$31
  Bottom 0.406: R8.2 54.17,36.92 54.89,36.92 55.13,36.69 C2.2 52.65,34.2 R7.1 50.16,34.14 Q1.B
N$32
  Top 0.406: IC2.6 16.8,6.25 17.19,6.65 28.62,6.57 29.26,7.2 29.34,9.35 29.34,15.38 29.97,16.01 34.58,16.01 37.51,18.95 R26.1
N$33
  Top 0.406: IC2.5 15.53,1.88 15.76,1.65 31.56,1.65 32.2,2.28 32.2,13 34.58,13 R25.1
N$34
  Top 0.406: IC2.4 14.26,1.17 14.65,0.77 33.62,0.77 34.26,1.41 34.26,3.62 R24.1
N$50
  Bottom 0.406: IC1.5 54.76,24.27 R2.1 54.26,21.85 R1.2
N$51
  Top 0.813: D1.C 61.62,16.52 L1.2
  Bottom 0.61: IC1.2 58.87,19.04 58.87,16.73 59.08,16.52 L1.2
N$52
  Bottom 0.406: C5.1 57.6,17.02 57.55,17.38 57.55,18.99 IC1.3
N$55
  Top 0.406: D10.A 52.31,20.06 51.56,20.81 51.56,22.31 R4.1 51.24,22.33 49.58,23.99 49.58,26.05 50.77,27.24 50.77,27.99 R10.2
N$58
  Top 0.406: 58.11,19.54 D13.C 58.13,19.57 D10.C
N$63
  Bottom 0.406: IC1.8 60.17,26.86 R19.1 | IC1.8 IC1.7 | IC1.1 IC1.8
N$77
  Bottom 0.406: C2.1 56.66,31.4 R13.1
P0.0
  Bottom 0.406: U1.1 25.92,10.07 25.92,5.38 29.89,1.41 53.23,1.41 54.82,3 JP1.7
P0.2
  Bottom 0.406: U1.19 17.67,13.24 20.45,13.24 24.1,9.58 24.1,4.66 28.15,0.61 55.93,0.61 57.36,2.04 JP1.9
P0.3
  Bottom 0.406: U1.18 15.06,18.39 23.15,18.39 31.8,9.74 54.82,9.74 57.36,7.2 JP1.10
P04
  Top 0.406: IC2.14 12.99,12.92 11.56,14.35 11.56,21.17 12.67,22.28 13.71,22.28 U1.17
P05  (via drill 0.6)
  Top 0.406: IC2.11 16.8,11.49 16.8,12.04 v16.8,24.9
  Bottom 0.406: v16.8,24.9 13.87,24.9 U1.16
P06
  Top 0.406: IC2.12 15.53,12.36 15.61,13.63 15.61,28.95 15.13,29.82 13.79,29.82 U1.14
PROG
  Bottom 0.406: U1.2 26.8,11.73 26.8,7.44 27.91,6.33 37.67,6.33 39.82,8.47 48.63,8.47 49.74,7.28 JP1.4
PWM  (via drill 0.6)
  Top 0.406: v26.96,16.49 26.32,15.85 18.54,15.85 18.07,16.25 18.07,29.9 v17.59,30.38 | v48.47,10.85 48.47,9.58 48.47,7.84 48.47,5.22 JP1.3
  Bottom 0.406: R18.2 21.31,37.42 U1.10 21.33,37.52 18.62,37.52 18.15,37.05 18.15,32.92 17.59,32.36 v17.59,30.38 | v26.96,16.49 26.96,16.41 32.51,10.85 v48.47,10.85
VCC  (via drill 0.6)
  Top 0.406: JP3.1 9.26,23 9.26,12.2 10.37,11.09 IC2.16 9.6,9.56 v8.94,9.74 | v18.94,12.2 18.7,12.2 18.07,11.57 IC2.10 | IC2.10 | JP1.5 51.01,5.22 51.01,11.01 49.42,12.6 48.44,12.6 C4.2 48.4,14.84 IC3.OUT | v43.31,35.14 v43.31,30.86 43.31,25.94 v43.63,25.62 | v42.43,13 42.43,11.17 42.99,10.61 | v45.69,23.55 44.9,23.55 43.39,22.05 43.39,20.78 42.59,19.98 v42.59,18.39
  Top 0.61: v38.15,8.55 38.31,8.47 40.45,8.47 42.59,10.61 42.99,10.61 46.37,10.61 C4.2 | v27.99,8.55 22.11,8.55 21.32,9.35 21.32,11.01 20.13,12.2 v18.94,12.2
  Bottom 0.406: 45.75,36.59 R17.1 43.41,36.59 43.31,36.49 v43.31,35.14 | JP3.1 8.46,23.08 6.4,23.08 6.08,23.4 6.08,28.16 7.35,29.43 10.68,29.43 12.43,31.17 16.32,31.17 16.64,31.49 16.64,34.86 R12.1 16.59,37.34 R18.1 | v8.94,9.74 16.48,9.74 v18.94,12.2 | R7.2 43.75,31.3 v43.31,30.86 | v45.69,23.55 v43.63,25.62 | v42.59,18.39 42.59,13.16 v42.43,13
  Bottom 0.61: v27.99,8.55 v38.15,8.55
VCC_LPC
  Bottom 0.406: JP3.2 11,25.62 12.75,27.36 13.71,27.36 U1.15 16.28,27.32 17.59,28.63 27.04,28.63 Q4.4 Q4.1 27.04,22.78 C7.1
VDD
  Top 0.61: IC4.OUT 62.28,5.06 58.55,8.79 52.83,8.79 52.28,8.23 JP1.6

### Text on the board
tPlace: +
tNames: GND | VCC | ISP